# Altium project Marsault1.PrjPcb (part 1 of 7)
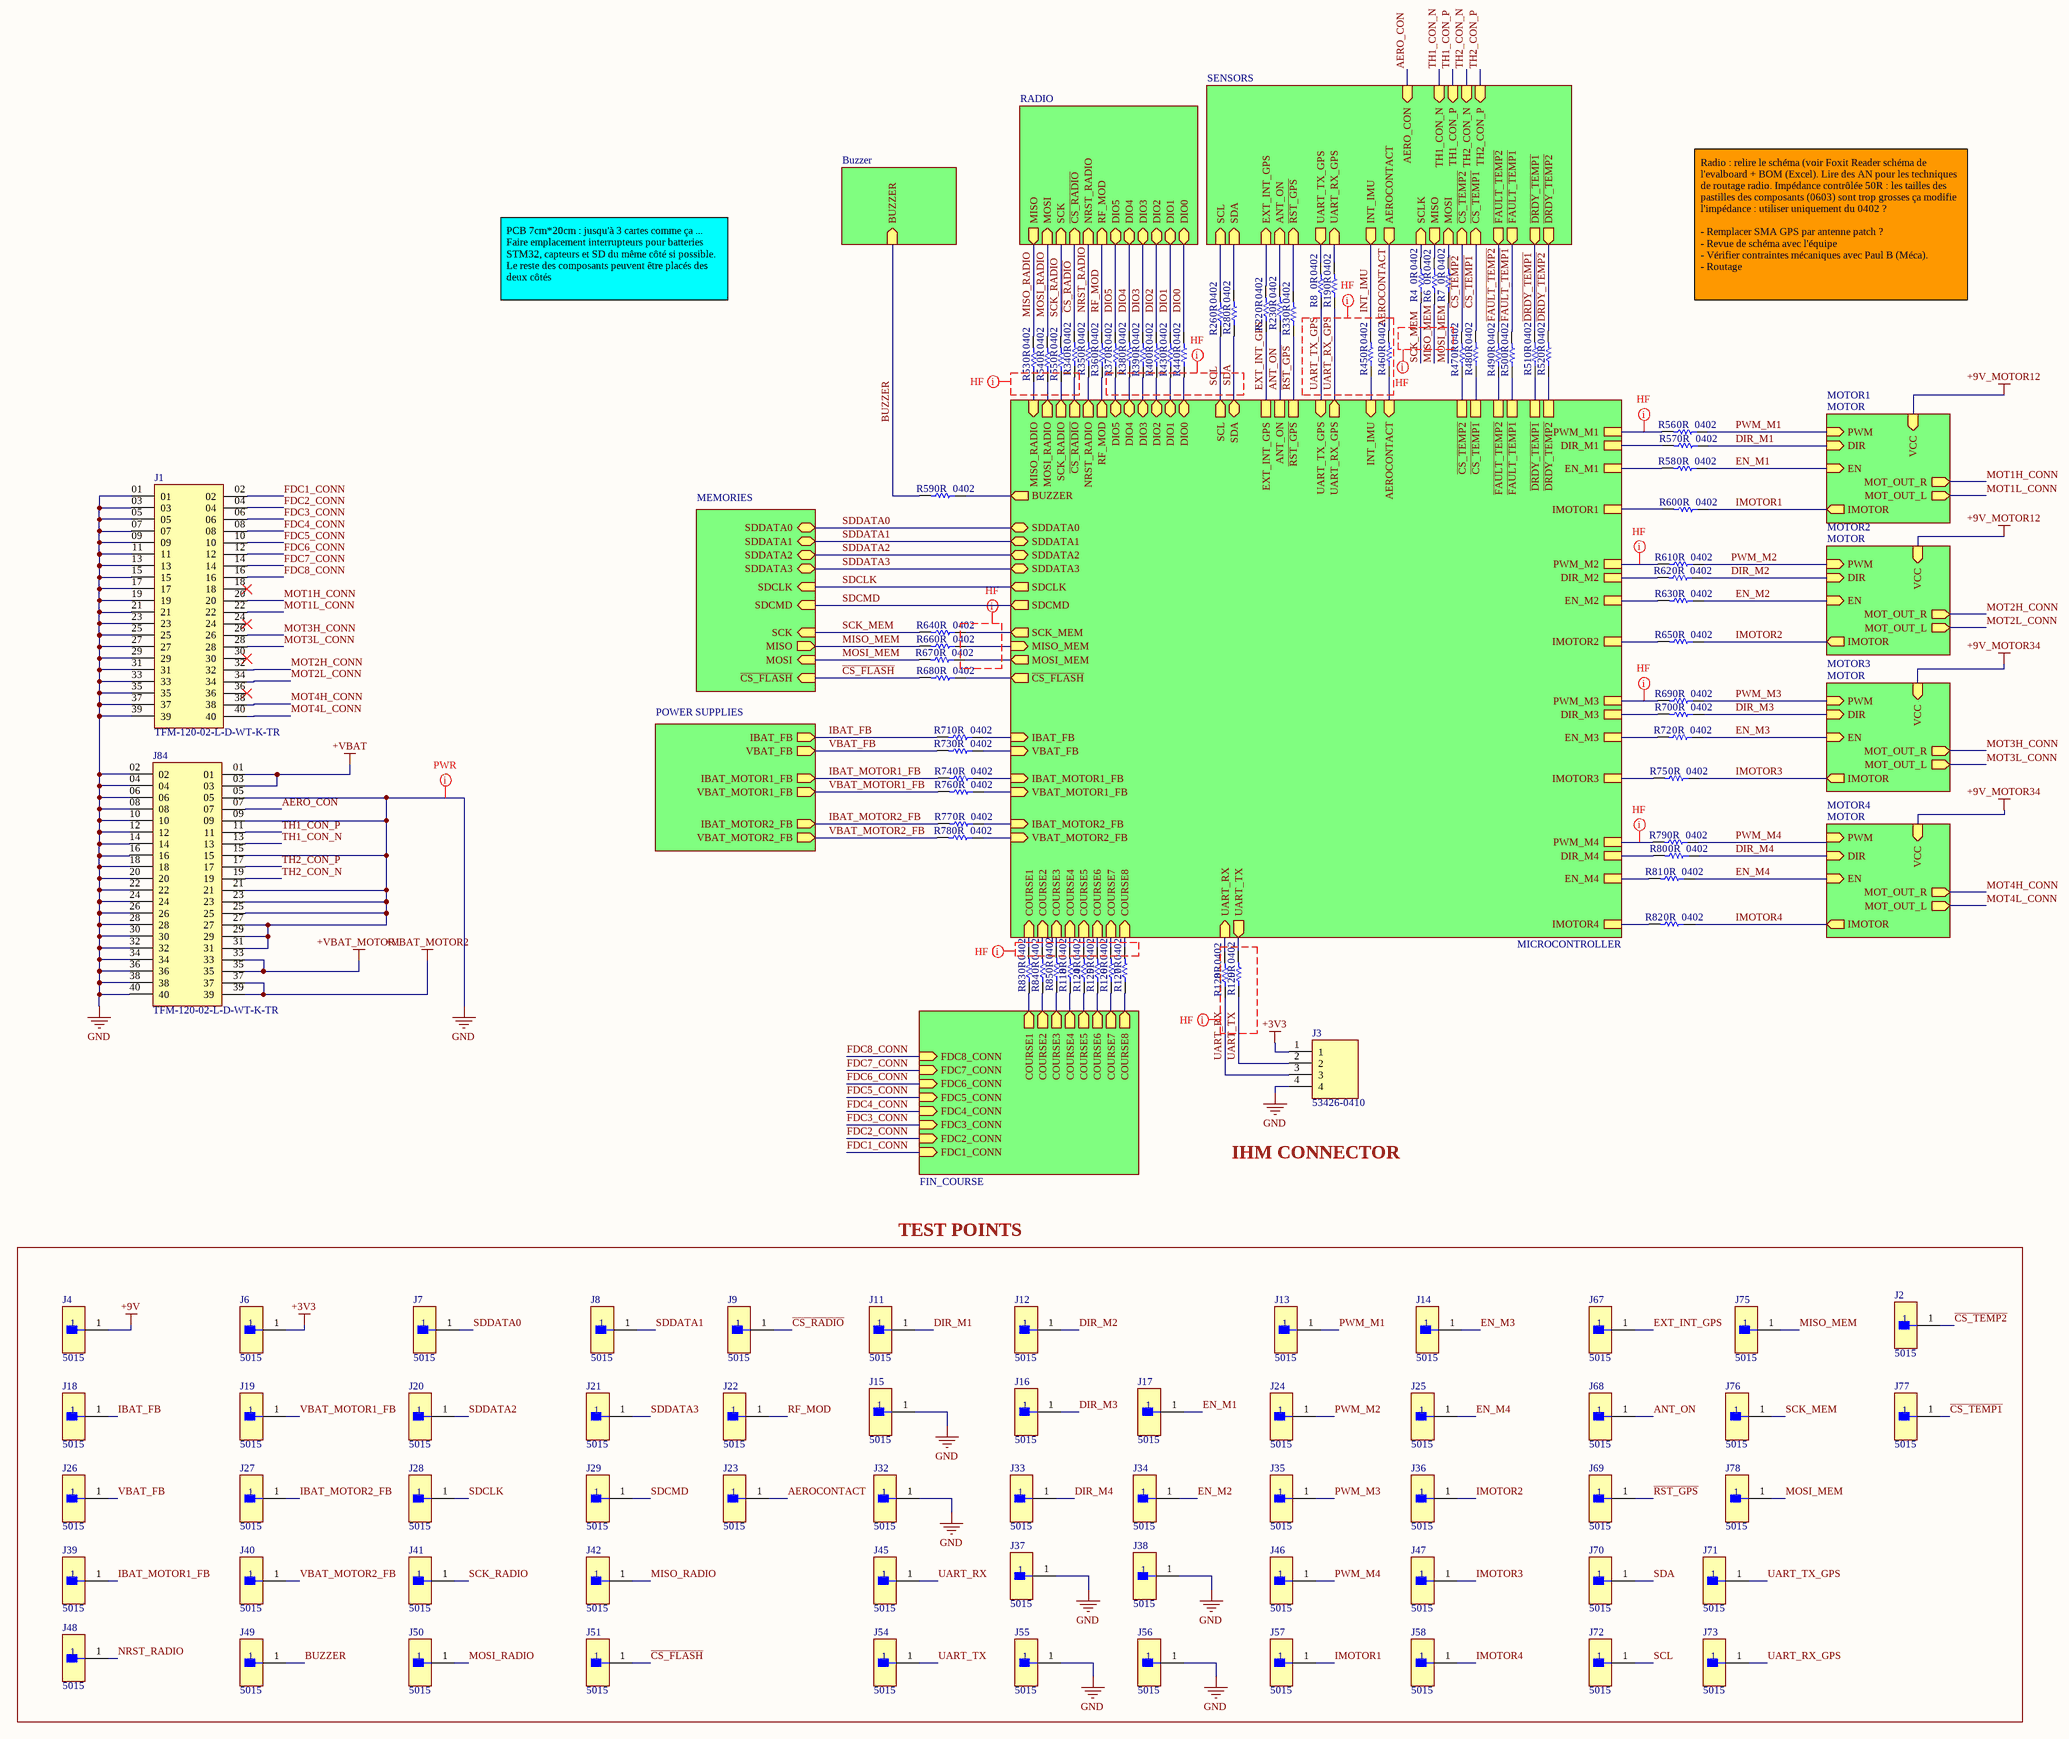
[diagram p0: MAIN.SchDoc]
8 sheets, 422 parts. Net scope: hierarchical (ports join the sheet entries above them; power ports are global).
Board file: PCB1.PcbDoc
Sheets:
  MAIN.SchDoc
    POWER SUPPLIES = POWER.SchDoc
    MEMORIES = MEMORIES.SchDoc
    MICROCONTROLLER = MICROCONTROLLER.SchDoc
    SENSORS = SENSORS.SchDoc
    MOTOR1 = MOTOR.SchDoc
    MOTOR2 = MOTOR.SchDoc
    MOTOR3 = MOTOR.SchDoc
    MOTOR4 = MOTOR.SchDoc
    RADIO = RADIO.SchDoc
    Buzzer = Buzzer.SchDoc

## Sheet MAIN.SchDoc
size A2; SheetNumber: 1; SheetTotal: 9

### Parts
J1  TFM-120-02-L-D-WT-K-TR  [SAMTEC_TFM-120-02-L-D-WT-K-TR]
J2  5015  [FP-5015-MFG]
J3  53426-0410  [SHDRRA4W55P0X250_1X4_1240X1150X690P]
J4  5015  [FP-5015-MFG]
J6  5015  [FP-5015-MFG]
J7  5015  [FP-5015-MFG]
J8  5015  [FP-5015-MFG]
J9  5015  [FP-5015-MFG]
J11  5015  [FP-5015-MFG]
J12  5015  [FP-5015-MFG]
J13  5015  [FP-5015-MFG]
J14  5015  [FP-5015-MFG]
J15  5015  [FP-5015-MFG]
J16  5015  [FP-5015-MFG]
J17  5015  [FP-5015-MFG]
J18  5015  [FP-5015-MFG]
J19  5015  [FP-5015-MFG]
J20  5015  [FP-5015-MFG]
J21  5015  [FP-5015-MFG]
J22  5015  [FP-5015-MFG]
J23  5015  [FP-5015-MFG]
J24  5015  [FP-5015-MFG]
J25  5015  [FP-5015-MFG]
J26  5015  [FP-5015-MFG]
J27  5015  [FP-5015-MFG]
J28  5015  [FP-5015-MFG]
J29  5015  [FP-5015-MFG]
J32  5015  [FP-5015-MFG]
J33  5015  [FP-5015-MFG]
J34  5015  [FP-5015-MFG]
J35  5015  [FP-5015-MFG]
J36  5015  [FP-5015-MFG]
J37  5015  [FP-5015-MFG]
J38  5015  [FP-5015-MFG]
J39  5015  [FP-5015-MFG]
J40  5015  [FP-5015-MFG]
J41  5015  [FP-5015-MFG]
J42  5015  [FP-5015-MFG]
J45  5015  [FP-5015-MFG]
J46  5015  [FP-5015-MFG]
J47  5015  [FP-5015-MFG]
J48  5015  [FP-5015-MFG]
J49  5015  [FP-5015-MFG]
J50  5015  [FP-5015-MFG]
J51  5015  [FP-5015-MFG]
J54  5015  [FP-5015-MFG]
J55  5015  [FP-5015-MFG]
J56  5015  [FP-5015-MFG]
J57  5015  [FP-5015-MFG]
J58  5015  [FP-5015-MFG]
J67  5015  [FP-5015-MFG]
J68  5015  [FP-5015-MFG]
J69  5015  [FP-5015-MFG]
J70  5015  [FP-5015-MFG]
J71  5015  [FP-5015-MFG]
J72  5015  [FP-5015-MFG]
J73  5015  [FP-5015-MFG]
J75  5015  [FP-5015-MFG]
J76  5015  [FP-5015-MFG]
J77  5015  [FP-5015-MFG]
J78  5015  [FP-5015-MFG]
J84  TFM-120-02-L-D-WT-K-TR  [SAMTEC_TFM-120-02-L-D-WT-K-TR]
R4  Case Code (Imperial): 0402  Resistance: 0R  [RESC1005X40X25ML05T10]  (hidden comment: CRCW04020000Z0EDHP)
R6  Case Code (Imperial): 0402  Resistance: 0R  [RESC1005X40X25ML05T10]  (hidden comment: CRCW04020000Z0EDHP)
R7  Case Code (Imperial): 0402  Resistance: 0R  [RESC1005X40X25ML05T10]  (hidden comment: CRCW04020000Z0EDHP)
R8  Case Code (Imperial): 0402  Resistance: 0R  [RESC1005X40X25ML05T10]  (hidden comment: CRCW04020000Z0EDHP)
R19  Case Code (Imperial): 0402  Resistance: 0R  [RESC1005X40X25ML05T10]  (hidden comment: CRCW04020000Z0EDHP)
R22  Case Code (Imperial): 0402  Resistance: 0R  [RESC1005X40X25ML05T10]  (hidden comment: CRCW04020000Z0EDHP)
R23  Case Code (Imperial): 0402  Resistance: 0R  [RESC1005X40X25ML05T10]  (hidden comment: CRCW04020000Z0EDHP)
R26  Case Code (Imperial): 0402  Resistance: 0R  [RESC1005X40X25ML05T10]  (hidden comment: CRCW04020000Z0EDHP)
R28  Case Code (Imperial): 0402  Resistance: 0R  [RESC1005X40X25ML05T10]  (hidden comment: CRCW04020000Z0EDHP)
R33  Case Code (Imperial): 0402  Resistance: 0R  [RESC1005X40X25ML05T10]  (hidden comment: CRCW04020000Z0EDHP)
R34  Case Code (Imperial): 0402  Resistance: 0R  [RESC1005X40X25ML05T10]  (hidden comment: CRCW04020000Z0EDHP)
R35  Case Code (Imperial): 0402  Resistance: 0R  [RESC1005X40X25ML05T10]  (hidden comment: CRCW04020000Z0EDHP)
R36  Case Code (Imperial): 0402  Resistance: 0R  [RESC1005X40X25ML05T10]  (hidden comment: CRCW04020000Z0EDHP)
R37  Case Code (Imperial): 0402  Resistance: 0R  [RESC1005X40X25ML05T10]  (hidden comment: CRCW04020000Z0EDHP)
R38  Case Code (Imperial): 0402  Resistance: 0R  [RESC1005X40X25ML05T10]  (hidden comment: CRCW04020000Z0EDHP)
R39  Case Code (Imperial): 0402  Resistance: 0R  [RESC1005X40X25ML05T10]  (hidden comment: CRCW04020000Z0EDHP)
R40  Case Code (Imperial): 0402  Resistance: 0R  [RESC1005X40X25ML05T10]  (hidden comment: CRCW04020000Z0EDHP)
R43  Case Code (Imperial): 0402  Resistance: 0R  [RESC1005X40X25ML05T10]  (hidden comment: CRCW04020000Z0EDHP)
R44  Case Code (Imperial): 0402  Resistance: 0R  [RESC1005X40X25ML05T10]  (hidden comment: CRCW04020000Z0EDHP)
R45  Case Code (Imperial): 0402  Resistance: 0R  [RESC1005X40X25ML05T10]  (hidden comment: CRCW04020000Z0EDHP)
R46  Case Code (Imperial): 0402  Resistance: 0R  [RESC1005X40X25ML05T10]  (hidden comment: CRCW04020000Z0EDHP)
R47  Case Code (Imperial): 0402  Resistance: 0R  [RESC1005X40X25ML05T10]  (hidden comment: CRCW04020000Z0EDHP)
R48  Case Code (Imperial): 0402  Resistance: 0R  [RESC1005X40X25ML05T10]  (hidden comment: CRCW04020000Z0EDHP)
R49  Case Code (Imperial): 0402  Resistance: 0R  [RESC1005X40X25ML05T10]  (hidden comment: CRCW04020000Z0EDHP)
R50  Case Code (Imperial): 0402  Resistance: 0R  [RESC1005X40X25ML05T10]  (hidden comment: CRCW04020000Z0EDHP)
R51  Case Code (Imperial): 0402  Resistance: 0R  [RESC1005X40X25ML05T10]  (hidden comment: CRCW04020000Z0EDHP)
R52  Case Code (Imperial): 0402  Resistance: 0R  [RESC1005X40X25ML05T10]  (hidden comment: CRCW04020000Z0EDHP)
R53  Case Code (Imperial): 0402  Resistance: 0R  [RESC1005X40X25ML05T10]  (hidden comment: CRCW04020000Z0EDHP)
R54  Case Code (Imperial): 0402  Resistance: 0R  [RESC1005X40X25ML05T10]  (hidden comment: CRCW04020000Z0EDHP)
R55  Case Code (Imperial): 0402  Resistance: 0R  [RESC1005X40X25ML05T10]  (hidden comment: CRCW04020000Z0EDHP)
R56  Case Code (Imperial): 0402  Resistance: 0R  [RESC1005X40X25ML05T10]  (hidden comment: CRCW04020000Z0EDHP)
R57  Case Code (Imperial): 0402  Resistance: 0R  [RESC1005X40X25ML05T10]  (hidden comment: CRCW04020000Z0EDHP)
R58  Case Code (Imperial): 0402  Resistance: 0R  [RESC1005X40X25ML05T10]  (hidden comment: CRCW04020000Z0EDHP)
R59  Case Code (Imperial): 0402  Resistance: 0R  [RESC1005X40X25ML05T10]  (hidden comment: CRCW04020000Z0EDHP)
R60  Case Code (Imperial): 0402  Resistance: 0R  [RESC1005X40X25ML05T10]  (hidden comment: CRCW04020000Z0EDHP)
R61  Case Code (Imperial): 0402  Resistance: 0R  [RESC1005X40X25ML05T10]  (hidden comment: CRCW04020000Z0EDHP)
R62  Case Code (Imperial): 0402  Resistance: 0R  [RESC1005X40X25ML05T10]  (hidden comment: CRCW04020000Z0EDHP)
R63  Case Code (Imperial): 0402  Resistance: 0R  [RESC1005X40X25ML05T10]  (hidden comment: CRCW04020000Z0EDHP)
R64  Case Code (Imperial): 0402  Resistance: 0R  [RESC1005X40X25ML05T10]  (hidden comment: CRCW04020000Z0EDHP)
R65  Case Code (Imperial): 0402  Resistance: 0R  [RESC1005X40X25ML05T10]  (hidden comment: CRCW04020000Z0EDHP)
R66  Case Code (Imperial): 0402  Resistance: 0R  [RESC1005X40X25ML05T10]  (hidden comment: CRCW04020000Z0EDHP)
R67  Case Code (Imperial): 0402  Resistance: 0R  [RESC1005X40X25ML05T10]  (hidden comment: CRCW04020000Z0EDHP)
R68  Case Code (Imperial): 0402  Resistance: 0R  [RESC1005X40X25ML05T10]  (hidden comment: CRCW04020000Z0EDHP)
R69  Case Code (Imperial): 0402  Resistance: 0R  [RESC1005X40X25ML05T10]  (hidden comment: CRCW04020000Z0EDHP)
R70  Case Code (Imperial): 0402  Resistance: 0R  [RESC1005X40X25ML05T10]  (hidden comment: CRCW04020000Z0EDHP)
R71  Case Code (Imperial): 0402  Resistance: 0R  [RESC1005X40X25ML05T10]  (hidden comment: CRCW04020000Z0EDHP)
R72  Case Code (Imperial): 0402  Resistance: 0R  [RESC1005X40X25ML05T10]  (hidden comment: CRCW04020000Z0EDHP)
R73  Case Code (Imperial): 0402  Resistance: 0R  [RESC1005X40X25ML05T10]  (hidden comment: CRCW04020000Z0EDHP)
R74  Case Code (Imperial): 0402  Resistance: 0R  [RESC1005X40X25ML05T10]  (hidden comment: CRCW04020000Z0EDHP)
R75  Case Code (Imperial): 0402  Resistance: 0R  [RESC1005X40X25ML05T10]  (hidden comment: CRCW04020000Z0EDHP)
R76  Case Code (Imperial): 0402  Resistance: 0R  [RESC1005X40X25ML05T10]  (hidden comment: CRCW04020000Z0EDHP)
R77  Case Code (Imperial): 0402  Resistance: 0R  [RESC1005X40X25ML05T10]  (hidden comment: CRCW04020000Z0EDHP)
R78  Case Code (Imperial): 0402  Resistance: 0R  [RESC1005X40X25ML05T10]  (hidden comment: CRCW04020000Z0EDHP)
R79  Case Code (Imperial): 0402  Resistance: 0R  [RESC1005X40X25ML05T10]  (hidden comment: CRCW04020000Z0EDHP)
R80  Case Code (Imperial): 0402  Resistance: 0R  [RESC1005X40X25ML05T10]  (hidden comment: CRCW04020000Z0EDHP)
R81  Case Code (Imperial): 0402  Resistance: 0R  [RESC1005X40X25ML05T10]  (hidden comment: CRCW04020000Z0EDHP)
R82  Case Code (Imperial): 0402  Resistance: 0R  [RESC1005X40X25ML05T10]  (hidden comment: CRCW04020000Z0EDHP)
R83  Case Code (Imperial): 0402  Resistance: 0R  [RESC1005X40X25ML05T10]  (hidden comment: CRCW04020000Z0EDHP)
R84  Case Code (Imperial): 0402  Resistance: 0R  [RESC1005X40X25ML05T10]  (hidden comment: CRCW04020000Z0EDHP)
R85  Case Code (Imperial): 0402  Resistance: 0R  [RESC1005X40X25ML05T10]  (hidden comment: CRCW04020000Z0EDHP)
R118  Case Code (Imperial): 0402  Resistance: 0R  [RESC1005X40X25ML05T10]  (hidden comment: CRCW04020000Z0EDHP)
R124  Case Code (Imperial): 0402  Resistance: 0R  [RESC1005X40X25ML05T10]  (hidden comment: CRCW04020000Z0EDHP)
R125  Case Code (Imperial): 0402  Resistance: 0R  [RESC1005X40X25ML05T10]  (hidden comment: CRCW04020000Z0EDHP)
R126  Case Code (Imperial): 0402  Resistance: 0R  [RESC1005X40X25ML05T10]  (hidden comment: CRCW04020000Z0EDHP)
R127  Case Code (Imperial): 0402  Resistance: 0R  [RESC1005X40X25ML05T10]  (hidden comment: CRCW04020000Z0EDHP)
R128  Case Code (Imperial): 0402  Resistance: 0R  [RESC1005X40X25ML05T10]  (hidden comment: CRCW04020000Z0EDHP)
R129  Case Code (Imperial): 0402  Resistance: 0R  [RESC1005X40X25ML05T10]  (hidden comment: CRCW04020000Z0EDHP)

### Sub-sheets
Buzzer = Buzzer: BUZZER (in)
FIN_COURSE = FIN_COURSE (file not in this document): COURSE1 (out), COURSE8 (out), COURSE7 (out), COURSE6 (out), COURSE4 (out), COURSE2 (out), COURSE5 (out), COURSE3 (out), FDC8_CONN (in), FDC7_CONN (in), FDC6_CONN (in), FDC5_CONN (in), FDC4_CONN (in), FDC3_CONN (in), FDC2_CONN (in), FDC1_CONN (in)
MEMORIES = MEMORIES: SDDATA1 (bidir), SCK (in), MISO (out), SDCMD (in), SDDATA0 (bidir), SDDATA2 (bidir), SDCLK (in), SDDATA3 (bidir), ~{CS_FLASH} (in), MOSI (in)
MICROCONTROLLER = MICROCONTROLLER: IMOTOR4, IBAT_FB (in), VBAT_FB (in), IBAT_MOTOR1_FB (in), VBAT_MOTOR1_FB (in), IBAT_MOTOR2_FB (in), VBAT_MOTOR2_FB (in), INT_IMU (in), DIO0 (bidir), DIO1 (bidir), DIO2 (bidir), DIO3 (bidir), DIO4 (bidir), DIO5 (bidir), RF_MOD (out), NRST_RADIO (out), ~{CS_RADIO} (out), SDDATA0 (bidir), SDDATA1 (bidir), SDDATA2 (bidir), SDDATA3 (bidir), SDCLK (out), SDCMD (out), SCK_MEM (out), MISO_MEM (in), MOSI_MEM (out), ~{CS_FLASH} (out), AEROCONTACT (in), BUZZER (out), UART_RX (in), UART_TX (out), PWM_M1, DIR_M1, EN_M1, IMOTOR1, PWM_M2, DIR_M2, EN_M2, IMOTOR2, PWM_M3, DIR_M3, EN_M3, IMOTOR3, PWM_M4, DIR_M4, EN_M4, SCL (out), SDA (bidir), EXT_INT_GPS, ANT_ON, ~{RST_GPS}, UART_TX_GPS (in), UART_RX_GPS (out), SCK_RADIO (out), MOSI_RADIO (out), MISO_RADIO (in), COURSE1 (in), COURSE2 (in), COURSE3 (in), COURSE4 (in), COURSE5 (in), COURSE6 (in), COURSE7 (in), COURSE8 (in), ~{CS_TEMP2}, ~{CS_TEMP1}, ~{FAULT_TEMP2}, ~{FAULT_TEMP1}, ~{DRDY_TEMP1}, ~{DRDY_TEMP2}
MOTOR1 = MOTOR: IMOTOR (out), DIR (in), PWM (in), EN (in), VCC (in), MOT_OUT_R (out), MOT_OUT_L (out)
MOTOR2 = MOTOR: IMOTOR (out), EN (in), PWM (in), DIR (in), VCC (in), MOT_OUT_R (out), MOT_OUT_L (out)
MOTOR3 = MOTOR: IMOTOR (out), EN (in), DIR (in), PWM (in), VCC (in), MOT_OUT_L (out), MOT_OUT_R (out)
MOTOR4 = MOTOR: IMOTOR (out), PWM (in), EN (in), DIR (in), VCC (in), MOT_OUT_L (out), MOT_OUT_R (out)
POWER SUPPLIES = POWER: VBAT_FB (out), IBAT_MOTOR1_FB (out), VBAT_MOTOR1_FB (out), IBAT_FB (out), IBAT_MOTOR2_FB (out), VBAT_MOTOR2_FB (out)
RADIO = RADIO: ~{CS_RADIO} (in), DIO0 (bidir), DIO2 (bidir), NRST_RADIO (in), DIO1 (bidir), DIO4 (bidir), RF_MOD (in), DIO3 (bidir), DIO5 (bidir), SCK (in), MOSI (in), MISO (out)
SENSORS = SENSORS: INT_IMU (out), AEROCONTACT (out), SCL (in), SDA (in), EXT_INT_GPS (in), ANT_ON (in), UART_TX_GPS (out), ~{RST_GPS} (in), UART_RX_GPS (in), SCLK (in), ~{FAULT_TEMP2} (out), ~{CS_TEMP1} (in), ~{CS_TEMP2} (in), ~{DRDY_TEMP1} (out), ~{DRDY_TEMP2} (out), MISO (out), MOSI (in), ~{FAULT_TEMP1} (out), TH1_CON_N (in), TH1_CON_P (in), TH2_CON_N (in), TH2_CON_P (in), AERO_CON (in)

### Nets
+3V3: J3.1 J6.1
+9V: J4.1
+9V_MOTOR12: sheet MOTOR1/VCC, sheet MOTOR2/VCC  [project net VCC_PWR]
+9V_MOTOR34: sheet MOTOR3/VCC, sheet MOTOR4/VCC  [project net VCC_PWR]
+VBAT: J84.01 J84.03
+VBAT_MOTOR1: J84.33 J84.35
+VBAT_MOTOR2: J84.37 J84.39
GND: J1.01 J1.03 J1.05 J1.07 J1.09 J1.11 J1.13 J1.15 J1.17 J1.19 J1.21 J1.23 J1.25 J1.27 J1.29 J1.31 J1.33 J1.35 J1.37 J1.39 J3.4 J15.1 J32.1 J37.1 J38.1 J55.1 J56.1 J84.02 J84.04 J84.05 J84.06 J84.08 J84.09 J84.10 J84.12 J84.14 J84.15 J84.16 J84.18 J84.20 J84.21 J84.22 J84.23 J84.24 J84.25 J84.26 J84.27 J84.28 J84.29 J84.30 J84.31 J84.32 J84.34 J84.36 J84.38 J84.40
~{CS_FLASH}: J51.1 R68.2 ; sheet MEMORIES/~{CS_FLASH}
~{CS_RADIO}: J9.1 R34.2 ; sheet RADIO/~{CS_RADIO}
~{CS_TEMP1}: J77.1 R48.2 ; sheet SENSORS/~{CS_TEMP1}
~{CS_TEMP2}: J2.1 R47.2 ; sheet SENSORS/~{CS_TEMP2}
~{DRDY_TEMP1}: R51.2 ; sheet SENSORS/~{DRDY_TEMP1}
~{DRDY_TEMP2}: R52.2 ; sheet SENSORS/~{DRDY_TEMP2}
~{FAULT_TEMP1}: R50.2 ; sheet SENSORS/~{FAULT_TEMP1}
~{FAULT_TEMP2}: R49.2 ; sheet SENSORS/~{FAULT_TEMP2}
~{RST_GPS}: J69.1 R33.1 ; sheet MICROCONTROLLER/~{RST_GPS}
AERO_CON: J84.07 ; sheet SENSORS/AERO_CON
AEROCONTACT: J23.1 R46.2 ; sheet SENSORS/AEROCONTACT
ANT_ON: J68.1 R23.1 ; sheet MICROCONTROLLER/ANT_ON
BUZZER: J49.1 R59.2 ; sheet Buzzer/BUZZER
DIO0: R44.2 ; sheet RADIO/DIO0
DIO1: R43.2 ; sheet RADIO/DIO1
DIO2: R40.2 ; sheet RADIO/DIO2
DIO3: R39.2 ; sheet RADIO/DIO3
DIO4: R38.2 ; sheet RADIO/DIO4
DIO5: R37.2 ; sheet RADIO/DIO5
DIR_M1: J11.1 R57.1 ; sheet MOTOR1/DIR
DIR_M2: J12.1 R62.1 ; sheet MOTOR2/DIR
DIR_M3: J16.1 R70.1 ; sheet MOTOR3/DIR
DIR_M4: J33.1 R80.1 ; sheet MOTOR4/DIR
EN_M1: J17.1 R58.1 ; sheet MOTOR1/EN
EN_M2: J34.1 R63.1 ; sheet MOTOR2/EN
EN_M3: J14.1 R72.1 ; sheet MOTOR3/EN
EN_M4: J25.1 R81.1 ; sheet MOTOR4/EN
EXT_INT_GPS: J67.1 R22.1 ; sheet MICROCONTROLLER/EXT_INT_GPS
FDC1_CONN: J1.02 ; sheet FIN_COURSE/FDC1_CONN
FDC2_CONN: J1.04 ; sheet FIN_COURSE/FDC2_CONN
FDC3_CONN: J1.06 ; sheet FIN_COURSE/FDC3_CONN
FDC4_CONN: J1.08 ; sheet FIN_COURSE/FDC4_CONN
FDC5_CONN: J1.10 ; sheet FIN_COURSE/FDC5_CONN
FDC6_CONN: J1.12 ; sheet FIN_COURSE/FDC6_CONN
FDC7_CONN: J1.14 ; sheet FIN_COURSE/FDC7_CONN
FDC8_CONN: J1.16 ; sheet FIN_COURSE/FDC8_CONN
IBAT_FB: J18.1 R71.2 ; sheet POWER SUPPLIES/IBAT_FB
IBAT_MOTOR1_FB: J39.1 R74.2 ; sheet POWER SUPPLIES/IBAT_MOTOR1_FB
IBAT_MOTOR2_FB: J27.1 R77.2 ; sheet POWER SUPPLIES/IBAT_MOTOR2_FB
IMOTOR1: J57.1 R60.1 ; sheet MOTOR1/IMOTOR
IMOTOR2: J36.1 R65.1 ; sheet MOTOR2/IMOTOR
IMOTOR3: J47.1 R75.1 ; sheet MOTOR3/IMOTOR
IMOTOR4: J58.1 R82.1 ; sheet MOTOR4/IMOTOR
INT_IMU: R45.2 ; sheet SENSORS/INT_IMU
MISO: R6.2 ; sheet SENSORS/MISO
MISO_MEM: J75.1 R6.1 R66.2 ; sheet MEMORIES/MISO
MISO_RADIO: J42.1 R53.2 ; sheet RADIO/MISO
MOSI: R7.2 ; sheet SENSORS/MOSI
MOSI_MEM: J78.1 R7.1 R67.2 ; sheet MEMORIES/MOSI
MOSI_RADIO: J50.1 R54.2 ; sheet RADIO/MOSI
MOT1H_CONN: J1.20 ; sheet MOTOR1/MOT_OUT_R  [project net HOT_R]
MOT1L_CONN: J1.22 ; sheet MOTOR1/MOT_OUT_L  [project net HOT_L]
MOT2H_CONN: J1.32 ; sheet MOTOR2/MOT_OUT_R  [project net HOT_R]
MOT2L_CONN: J1.34 ; sheet MOTOR2/MOT_OUT_L  [project net HOT_L]
MOT3H_CONN: J1.26 ; sheet MOTOR3/MOT_OUT_R  [project net HOT_R]
MOT3L_CONN: J1.28 ; sheet MOTOR3/MOT_OUT_L  [project net HOT_L]
MOT4H_CONN: J1.38 ; sheet MOTOR4/MOT_OUT_R  [project net HOT_R]
MOT4L_CONN: J1.40 ; sheet MOTOR4/MOT_OUT_L  [project net HOT_L]
NRST_RADIO: J48.1 R35.2 ; sheet RADIO/NRST_RADIO
PWM_M1: J13.1 R56.1 ; sheet MOTOR1/PWM
PWM_M2: J24.1 R61.1 ; sheet MOTOR2/PWM
PWM_M3: J35.1 R69.1 ; sheet MOTOR3/PWM
PWM_M4: J46.1 R79.1
RF_MOD: J22.1 R36.2 ; sheet RADIO/RF_MOD
SCK_MEM: J76.1 R4.1 R64.2 ; sheet MEMORIES/SCK
SCK_RADIO: J41.1 R55.2 ; sheet RADIO/SCK
SCL: J72.1 R26.1 ; sheet MICROCONTROLLER/SCL
SCLK: R4.2 ; sheet SENSORS/SCLK
SDA: J70.1 R28.1 ; sheet MICROCONTROLLER/SDA
SDCLK: J28.1 ; sheet MEMORIES/SDCLK, sheet MICROCONTROLLER/SDCLK
SDCMD: J29.1 ; sheet MEMORIES/SDCMD, sheet MICROCONTROLLER/SDCMD
SDDATA0: J7.1 ; sheet MEMORIES/SDDATA0, sheet MICROCONTROLLER/SDDATA0
SDDATA1: J8.1 ; sheet MEMORIES/SDDATA1, sheet MICROCONTROLLER/SDDATA1
SDDATA2: J20.1 ; sheet MEMORIES/SDDATA2, sheet MICROCONTROLLER/SDDATA2
SDDATA3: J21.1 ; sheet MEMORIES/SDDATA3, sheet MICROCONTROLLER/SDDATA3
TH1_CON_N: J84.13 ; sheet SENSORS/TH1_CON_N
TH1_CON_P: J84.11 ; sheet SENSORS/TH1_CON_P
TH2_CON_N: J84.19 ; sheet SENSORS/TH2_CON_N
TH2_CON_P: J84.17 ; sheet SENSORS/TH2_CON_P
UART_RX: J3.3 J45.1 R128.1
UART_RX_GPS: J73.1 R19.1 ; sheet MICROCONTROLLER/UART_RX_GPS
UART_TX: J3.2 J54.1 R129.1
UART_TX_GPS: J71.1 R8.1 ; sheet MICROCONTROLLER/UART_TX_GPS
VBAT_FB: J26.1 R73.2 ; sheet POWER SUPPLIES/VBAT_FB
VBAT_MOTOR1_FB: J19.1 R76.2 ; sheet POWER SUPPLIES/VBAT_MOTOR1_FB
VBAT_MOTOR2_FB: J40.1 R78.2 ; sheet POWER SUPPLIES/VBAT_MOTOR2_FB
NetIC9_4: R22.2 ; sheet SENSORS/EXT_INT_GPS
NetIC9_8: R33.2 ; sheet SENSORS/~{RST_GPS}
NetIC9_14: R23.2 ; sheet SENSORS/ANT_ON
NetIC9_20: R8.2 ; sheet SENSORS/UART_TX_GPS
NetIC9_21: R19.2 ; sheet SENSORS/UART_RX_GPS
NetR26_2: R26.2 ; sheet SENSORS/SCL
NetR28_2: R28.2 ; sheet SENSORS/SDA
NetR34_1: R34.1 ; sheet MICROCONTROLLER/~{CS_RADIO}
NetR35_1: R35.1 ; sheet MICROCONTROLLER/NRST_RADIO
NetR36_1: R36.1 ; sheet MICROCONTROLLER/RF_MOD
NetR37_1: R37.1 ; sheet MICROCONTROLLER/DIO5
NetR38_1: R38.1 ; sheet MICROCONTROLLER/DIO4
NetR39_1: R39.1 ; sheet MICROCONTROLLER/DIO3
NetR40_1: R40.1 ; sheet MICROCONTROLLER/DIO2
NetR43_1: R43.1 ; sheet MICROCONTROLLER/DIO1
NetR44_1: R44.1 ; sheet MICROCONTROLLER/DIO0
NetR45_1: R45.1 ; sheet MICROCONTROLLER/INT_IMU
NetR46_1: R46.1 ; sheet MICROCONTROLLER/AEROCONTACT
NetR47_1: R47.1 ; sheet MICROCONTROLLER/~{CS_TEMP2}
NetR48_1: R48.1 ; sheet MICROCONTROLLER/~{CS_TEMP1}
NetR49_1: R49.1 ; sheet MICROCONTROLLER/~{FAULT_TEMP2}
NetR50_1: R50.1 ; sheet MICROCONTROLLER/~{FAULT_TEMP1}
NetR51_1: R51.1 ; sheet MICROCONTROLLER/~{DRDY_TEMP1}
NetR52_1: R52.1 ; sheet MICROCONTROLLER/~{DRDY_TEMP2}
NetR53_1: R53.1 ; sheet MICROCONTROLLER/MISO_RADIO
NetR54_1: R54.1 ; sheet MICROCONTROLLER/MOSI_RADIO
NetR55_1: R55.1 ; sheet MICROCONTROLLER/SCK_RADIO
NetR56_2: R56.2 ; sheet MICROCONTROLLER/PWM_M1
NetR57_2: R57.2 ; sheet MICROCONTROLLER/DIR_M1
NetR58_2: R58.2 ; sheet MICROCONTROLLER/EN_M1
NetR59_1: R59.1 ; sheet MICROCONTROLLER/BUZZER
NetR60_2: R60.2 ; sheet MICROCONTROLLER/IMOTOR1
NetR61_2: R61.2 ; sheet MICROCONTROLLER/PWM_M2
NetR62_2: R62.2 ; sheet MICROCONTROLLER/DIR_M2
NetR63_2: R63.2 ; sheet MICROCONTROLLER/EN_M2
NetR64_1: R64.1 ; sheet MICROCONTROLLER/SCK_MEM
NetR65_2: R65.2 ; sheet MICROCONTROLLER/IMOTOR2
NetR66_1: R66.1 ; sheet MICROCONTROLLER/MISO_MEM
NetR67_1: R67.1 ; sheet MICROCONTROLLER/MOSI_MEM
NetR68_1: R68.1 ; sheet MICROCONTROLLER/~{CS_FLASH}
NetR69_2: R69.2 ; sheet MICROCONTROLLER/PWM_M3
NetR70_2: R70.2 ; sheet MICROCONTROLLER/DIR_M3
NetR71_1: R71.1 ; sheet MICROCONTROLLER/IBAT_FB
NetR72_2: R72.2 ; sheet MICROCONTROLLER/EN_M3
NetR73_1: R73.1 ; sheet MICROCONTROLLER/VBAT_FB
NetR74_1: R74.1 ; sheet MICROCONTROLLER/IBAT_MOTOR1_FB
NetR75_2: R75.2 ; sheet MICROCONTROLLER/IMOTOR3
NetR76_1: R76.1 ; sheet MICROCONTROLLER/VBAT_MOTOR1_FB
NetR77_1: R77.1 ; sheet MICROCONTROLLER/IBAT_MOTOR2_FB
NetR78_1: R78.1 ; sheet MICROCONTROLLER/VBAT_MOTOR2_FB
NetR79_2: R79.2 ; sheet MICROCONTROLLER/PWM_M4
NetR80_2: R80.2 ; sheet MICROCONTROLLER/DIR_M4
NetR81_2: R81.2 ; sheet MICROCONTROLLER/EN_M4
NetR82_2: R82.2 ; sheet MICROCONTROLLER/IMOTOR4
NetR83_1: R83.1 ; sheet FIN_COURSE/COURSE1
NetR83_2: R83.2 ; sheet MICROCONTROLLER/COURSE1
NetR84_1: R84.1 ; sheet FIN_COURSE/COURSE2
NetR84_2: R84.2 ; sheet MICROCONTROLLER/COURSE2
NetR85_1: R85.1 ; sheet FIN_COURSE/COURSE3
NetR85_2: R85.2 ; sheet MICROCONTROLLER/COURSE3
NetR118_1: R118.1 ; sheet FIN_COURSE/COURSE4
NetR118_2: R118.2 ; sheet MICROCONTROLLER/COURSE4
NetR124_1: R124.1 ; sheet FIN_COURSE/COURSE5
NetR124_2: R124.2 ; sheet MICROCONTROLLER/COURSE5
NetR125_1: R125.1 ; sheet FIN_COURSE/COURSE6
NetR125_2: R125.2 ; sheet MICROCONTROLLER/COURSE6
NetR126_1: R126.1 ; sheet FIN_COURSE/COURSE7
NetR126_2: R126.2 ; sheet MICROCONTROLLER/COURSE7
NetR127_1: R127.1 ; sheet FIN_COURSE/COURSE8
NetR127_2: R127.2 ; sheet MICROCONTROLLER/COURSE8
NetR128_2: R128.2 ; sheet MICROCONTROLLER/UART_RX
NetR129_2: R129.2 ; sheet MICROCONTROLLER/UART_TX

Not connected (* = marked no-connect by the designer): J1 18* 24* 30* 36*

### Layout directives
net class HF: (no net found under the mark), AEROCONTACT, NetR56_2, NetR61_2, NetR69_2, NetR79_2, SCL, SDA, UART_RX_GPS, UART_TX_GPS
net class PWR: GND

### Notes on the sheet
- PCB 7cm*20cm : jusqu'à 3 cartes comme ça ...
  Faire emplacement interrupteurs pour batteries
  STM32, capteurs et SD du même côté si possible. Le reste des composants peuvent être placés des deux côtés
- Radio : relire le schéma (voir Foxit Reader schéma de l'evalboard + BOM (Excel). Lire des AN pour les techniques de routage radio. Impédance contrôlée 50R : les tailles des pastilles des composants (0603) sont trop grosses ça modifie l'impédance : utiliser uniquement du 0402 ?
  - Remplacer SMA GPS par antenne patch ?
  - Revue de schéma avec l'équipe
  - Vérifier contraintes mécaniques avec Paul B (Méca).
  - Routage
- IHM CONNECTOR
- TEST POINTS

### Library data of the parts
J1 J84 = TFM-120-02-L-D-WT-K-TR: MF: {'manufacturer': u'Samtec'}; MP: TFM-120-02-L-D-WT-K-TR; Value: *; Price: None; Availability: Unavailable; Package: None
J2 J4 J6-J9 J11-J29 J32-J42 J45-J51 J54-J58 J67-J73 J75-J78 = CMP-2000-05183-2: PC TEST POINT MINIATURE; Manufacturer: keystone; Number Of Contacts: 1; Conn Orientation: Straight; Category: Conn; Manufacturer Part Number: 5015; Digikey Description: PC TEST POINT MINIATURE; Automotive: No; Lead Free: Yes; Octopart: https://octopart.com/5015-keystone-3822; ComponentLink2URL: http://www.keyelco.com/product-pdf.cfm?p=1353; Package: 5015; RoHS: TRUE; Device Class L3: unset; Device Class L2: unset; Contact Material: Silver; Device Class L1: Connectors; Height: 1.65mm; ComponentLink2Description: Datasheet; Supplier 1: Mouser; Supplier Part Number 1: 534-5015; Stock 1: 1597055; Pricing 1: 1=0,45000, 10=0,43800, 25=0,36500, 50=0,36500, 100=0,30200, 250=0,27200, 500=0,25800, 1000=0,21300, 2000=0,19600, 5000=0,17200, 10000=0,17200 (USD); Mount: Surface Mount; Contact Plating: Silver,Tin,Lead; Material: Bronze,Silver; Color: White; Package Quantity: 1; Packaging: Tape and Reel; Series: -; Termination: Solder; Number of Ports: 1; Orientation: Straight; Length: 2.66mm; Depth: 1.01mm; Thickness: 0.01inch; REACH SVHC: No SVHC; RoHS Compliant: Yes; ComponentLink1URL: https://datasheet.ciiva.com/1123/5015-1123862.pdf?src-supplier=Newark; ComponentLink1Description: https://datasheet.ciiva.com/1123/5015-1123862.pdf?src-supplier=Newark; ComponentLink3URL: https://datasheet.ciiva.com/2917/5015-2917616.pdf?src-supplier=Digi-Key; ComponentLink3Description: https://datasheet.ciiva.com/2917/5015-2917616.pdf?src-supplier=Digi-Key; ComponentLink4URL: https://datasheet.ciiva.com/2917/5015-2917617.pdf?src-supplier=Digi-Key; ComponentLink4Description: https://datasheet.ciiva.com/2917/5015-2917617.pdf?src-supplier=Digi-Key; ComponentLink5URL: https://datasheet.ciiva.com/16883/70182998-16883734.pdf?src-supplier=Allied+Electronics; ComponentLink5Description: https://datasheet.ciiva.com/16883/70182998-16883734.pdf?src-supplier=Allied+Electronics
J3 = 53426-0410: Connector; Manufacturer_Name: Molex; Datasheet Link: https://www.molex.com/pdm_docs/sd/534260410_sd.pdf; Height: 6.9mm; Manufacturer_Part_Number: 53426-0410; Mouser Part Number: 538-53426-0410; Mouser Price/Stock: https://www.mouser.co.uk/ProductDetail/Molex/53426-0410?qs=9BfFgGvh7CdBwfW5YnFZ7w%3D%3D
R4 R6-R8 R19 R22 R23 R26 R28 R33-R40 R43-R85 R118 R124-R129 = CMP-2002-03041-1: Manufacturer: Vishay Dale; Voltage Rating: 50V; Power Rating: 200mW; Temperature Coefficient: 0ppm/°C; Max Power Dissipation: 125mW; Part Number: CRCW04020000Z0EDHP; Supplier 1: Mouser; Supplier Part Number 1: 71-CRCW04020000Z0EDH; Manufacturer Part Number: CRCW04020000Z0EDHP; RoHS: Yes; Category: Chip SMD Resistors; Stock 1: 2010; Pricing 1: 1=0,13000, 10=0,08600, 50=0,08600, 100=0,04000, 1000=0,01800, 10000=0,01200 (USD); Mount: Surface Mount; Case/Package: 0402; Case Code (Metric): 1005; Contact Plating: Tin; Weight: 2.3E-05oz; Size Code: 0402; Min Operating Temperature: -55°C; Max Operating Temperature: 155°C; Packaging: Tape and Reel; Resistor Type: Thick Film; Termination: SMD/SMT; Voltage Rating (DC): 50V; Package Quantity: 1; Series: CRCW-HP; Number of Terminations: 2; Technology: THICK FILM; Construction: Rectangular; Features: Automotive AEC-Q200; Length: 1mm; Width: 0.02inch; Height: 0.3mm; Depth: 0.5mm; Radiation Hardening: No; REACH SVHC: Unknown; RoHS Compliant: Yes; Military Standard: Not; Lead Free: Lead Free; ComponentLink1URL: https://datasheet.ciiva.com/16494/crcwhpe3-16494453.pdf?src-supplier=Future+Electronics; ComponentLink1Description: https://datasheet.ciiva.com/16494/crcwhpe3-16494453.pdf?src-supplier=Future+Electronics; ComponentLink2URL: https://datasheet.ciiva.com/2470/crcwhpe3-2470555.pdf?src-supplier=Digi-Key; ComponentLink2Description: https://datasheet.ciiva.com/2470/crcwhpe3-2470555.pdf?src-supplier=Digi-Key; ComponentLink3URL: https://datasheet.ciiva.com/5562/crcwhpe3-46056-5562315.pdf?src-supplier=Mouser; ComponentLink3Description: https://datasheet.ciiva.com/5562/crcwhpe3-46056-5562315.pdf?src-supplier=Mouser; ComponentLink4URL: https://datasheet.ciiva.com/9109/crcwhpe3-9109963.pdf?src-supplier=Avnet; ComponentLink4Description: https://datasheet.ciiva.com/9109/crcwhpe3-9109963.pdf?src-supplier=Avnet; ComponentLink5URL: https://datasheet.ciiva.com/2470/crcwhpe3-2470556.pdf?src-supplier=Digi-Key; ComponentLink5Description: https://datasheet.ciiva.com/2470/crcwhpe3-2470556.pdf?src-supplier=Digi-Key; ComponentLink6URL: https://datasheet.ciiva.com/28621/1912814-28621324.pdf?src-supplier=Element14; ComponentLink6Description: https://datasheet.ciiva.com/28621/1912814-28621324.pdf?src-supplier=Element14; ComponentLink7URL: https://datasheet.ciiva.com/2470/crcwhpe3-2470557.pdf?src-supplier=Digi-Key; ComponentLink7Description: https://datasheet.ciiva.com/2470/crcwhpe3-2470557.pdf?src-supplier=Digi-Key; ComponentLink8URL: https://datasheet.ciiva.com/7725/crcwhpe3-7725758.pdf?src-supplier=Element14; ComponentLink8Description: https://datasheet.ciiva.com/7725/crcwhpe3-7725758.pdf?src-supplier=Element14